# Altium schematic sheet akcelerometr.SchDoc: Akcelerometer
size A4
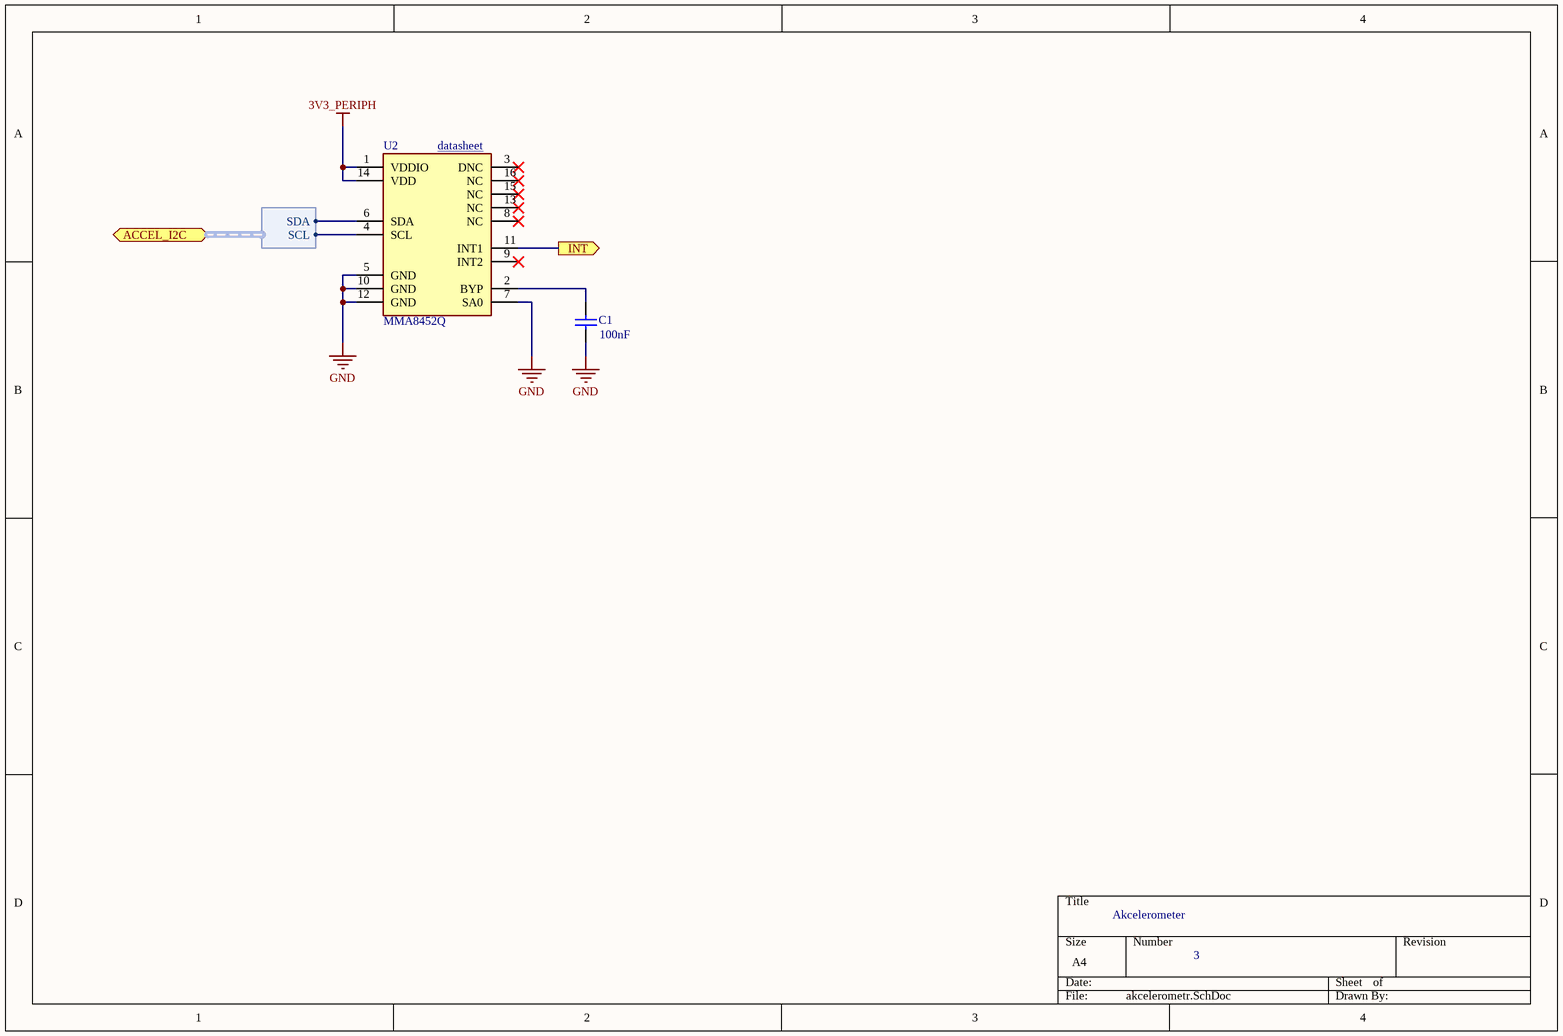
[diagram p0: akcelerometr.SchDoc]

## Parts
C1  value 100nF  [C0805]  (hidden comment: Cap)
U2  MMA8452Q  [QFN-16]

## Ports
ACCEL_I2C (harness I2C), INT (out)

## Harnesses
I2C: SDA, SCL

## Nets
3V3_PERIPH: U2.1(VDDIO) U2.14(VDD)
GND: C1.1 U2.5(GND) U2.7(SA0) U2.10(GND) U2.12(GND)
INT: U2.11(INT1) ; port INT
NetC1_2: C1.2 U2.2(BYP)
NetU2_4: U2.4(SCL) ; port ACCEL_I2C.SCL
NetU2_6: U2.6(SDA) ; port ACCEL_I2C.SDA

Not connected (* = marked no-connect by the designer): U2 3(DNC)* 8(NC)* 9(INT2)* 13(NC)* 15(NC)* 16(NC)*

## Notes on the sheet
- (near U2) datasheet <https://www.tme.eu/Document/9ec5aa089751e59cf0a8343add08639a/MMA8452Q.pdf>
- 3

## Library data of the parts
C1 = Cap: Capacitor; Published: 8-Jun-2000; LatestRevisionDate: 17-Jul-2002; LatestRevisionNote: Re-released for DXP Platform.; PackageReference: RAD-0.3; Publisher: Altium Limited; PackageDescription: Radial Cap, Thru-Hole; 2 Leads; 0.3 in Pin Spacing
U2 = MMA8452QR1: Accelerometer; Manufacturer_Name: NXP; Datasheet Link: http://www.nxp.com/docs/en/data-sheet/MMA8452Q.pdf; Height: 1mm; Manufacturer_Part_Number: MMA8452QR1; Arrow Part Number: MMA8452QR1; Arrow Price/Stock: https://www.arrow.com/en/products/mma8452qr1/nxp-semiconductors; Mouser Part Number: 841-MMA8452QR1; Mouser Price/Stock: https://www.mouser.co.uk/ProductDetail/NXP-Semiconductors/MMA8452QR1?qs=nf24X8JpkflP9lEXYucw7A%3D%3D